# Altium schematic sheet LEDs.SchDoc
size A; SheetNumber: 3; SheetTotal: 5
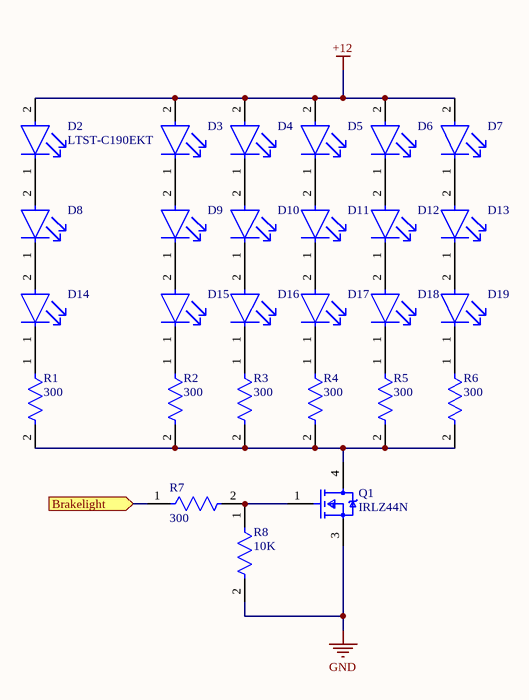
[diagram p0: LEDs.SchDoc]

## Parts
D2  LTST-C190EKT  [FP-LTST-C190EKT-MFG]
D3  LTST-C190EKT  [FP-LTST-C190EKT-MFG]  (value not drawn)
D4  LTST-C190EKT  [FP-LTST-C190EKT-MFG]  (value not drawn)
D5  LTST-C190EKT  [FP-LTST-C190EKT-MFG]  (value not drawn)
D6  LTST-C190EKT  [FP-LTST-C190EKT-MFG]  (value not drawn)
D7  LTST-C190EKT  [FP-LTST-C190EKT-MFG]  (value not drawn)
D8  LTST-C190EKT  [FP-LTST-C190EKT-MFG]  (value not drawn)
D9  LTST-C190EKT  [FP-LTST-C190EKT-MFG]  (value not drawn)
D10  LTST-C190EKT  [FP-LTST-C190EKT-MFG]  (value not drawn)
D11  LTST-C190EKT  [FP-LTST-C190EKT-MFG]  (value not drawn)
D12  LTST-C190EKT  [FP-LTST-C190EKT-MFG]  (value not drawn)
D13  LTST-C190EKT  [FP-LTST-C190EKT-MFG]  (value not drawn)
D14  LTST-C190EKT  [FP-LTST-C190EKT-MFG]  (value not drawn)
D15  LTST-C190EKT  [FP-LTST-C190EKT-MFG]  (value not drawn)
D16  LTST-C190EKT  [FP-LTST-C190EKT-MFG]  (value not drawn)
D17  LTST-C190EKT  [FP-LTST-C190EKT-MFG]  (value not drawn)
D18  LTST-C190EKT  [FP-LTST-C190EKT-MFG]  (value not drawn)
D19  LTST-C190EKT  [FP-LTST-C190EKT-MFG]  (value not drawn)
Q1  IRLZ44N  [FP-PG-TO263-3-MFG]
R1  300  [FP-CRCW1206-e3-IPC_A]
R2  300  [FP-CRCW1206-e3-IPC_A]
R3  300  [FP-CRCW1206-e3-IPC_A]
R4  300  [FP-CRCW1206-e3-IPC_A]
R5  300  [FP-CRCW1206-e3-IPC_A]
R6  300  [FP-CRCW1206-e3-IPC_A]
R7  300  [FP-CRCW1206-e3-IPC_A]
R8  10K  [FP-CRCW0603-e3-IPC_B]

## Ports
Brakelight (in)

## Nets
+12: D2.2(A) D3.2(A) D4.2(A) D5.2(A) D6.2(A) D7.2(A)
GND: Q1.3(S) R8.2
Brakelight: R7.1 ; port Brakelight
NetD2_1: D2.1(C) D8.2(A)
NetD3_1: D3.1(C) D9.2(A)
NetD4_1: D4.1(C) D10.2(A)
NetD5_1: D5.1(C) D11.2(A)
NetD6_1: D6.1(C) D12.2(A)
NetD7_1: D7.1(C) D13.2(A)
NetD8_1: D8.1(C) D14.2(A)
NetD9_1: D9.1(C) D15.2(A)
NetD10_1: D10.1(C) D16.2(A)
NetD11_1: D11.1(C) D17.2(A)
NetD12_1: D12.1(C) D18.2(A)
NetD13_1: D13.1(C) D19.2(A)
NetD14_1: D14.1(C) R1.1
NetD15_1: D15.1(C) R2.1
NetD16_1: D16.1(C) R3.1
NetD17_1: D17.1(C) R4.1
NetD18_1: D18.1(C) R5.1
NetD19_1: D19.1(C) R6.1
NetQ1_1: Q1.1(G) R7.2 R8.1
NetQ1_4: Q1.4(D) R1.2 R2.2 R3.2 R4.2 R5.2 R6.2

## Library data of the parts
D2-D19 = CMP-22017-000021-1: LED RED CLEAR CHIP SMD; Power Dissipation: 100mW; Lens Color: Colorless; Viewing Angle: 130°; Wavelength: 630nm; Number of Elements: 1; Reverse Voltage: 5V; Forward Current: 30mA; Dominant Wavelength: 621nm; Luminous Intensity: 2mcd; Test Current: 10mA; Forward Voltage: 2V; Length: 1.6mm; Lead Free: Lead Free; Lens Transparency: Clear; Max Operating Temperature: 85°C; Case Code (Metric): 1608; Case Code (Imperial): 0603; Number of Pins: 2; Color: Red; Depth: 0.8mm; Lens Style: Clear; Packaging: Tape and Reel; Height: 0.8mm; Case/Package: 0603; Min Operating Temperature: -55°C; Number of LEDs: 1; Illumination Color: Red; Mount: Surface Mount; Package Quantity: 1; Max Power Dissipation: 100mW; Power Rating: 100mW; Width: 0.8mm; Radiation Hardening: No
Q1 = CMP-32901-000495-1: MOSFET N-CH 55V 47A D2PAK; Rds On Max: 22mR; Input Capacitance: 1.7nF; Turn-On Delay Time: 11ns; Turn-Off Delay Time: 26ns; Power Dissipation: 110W; Element Configuration: Single; Gate to Source Voltage (Vgs): 16V; Drain to Source Resistance: 35mR; Threshold Voltage: 2V; Max Power Dissipation: 3.8W; Lead Free: Contains Lead; Max Dual Supply Voltage: 55V; Width: 0.38inch; Mount: Surface Mount; Continuous Drain Current (ID): 47A; Min Operating Temperature: -55°C; Number of Pins: 3; REACH SVHC: No SVHC; Height: 0.19inch; Length: 0.42inch; Case/Package: D2PAK; Drain to Source Breakdown Voltage: 55V; Packaging: Tape and Reel; Drain to Source Voltage (Vdss): 55V; Halogen Free: Halogen Free; RoHS Compliant: Yes; Max Operating Temperature: 175°C
R1-R7 = CMP-1014-00449-3: RES Thick Film, 300Ω, 1%, 0.25W, 100ppm/°C, 1206; Voltage Rating (DC): 200V; Power Rating: 250mW; Resistance: 300R; Number of Terminations: 2; Weight: 0.000353oz; Max Operating Temperature: 155°C; Features: Automotive AEC-Q200; Min Operating Temperature: -55°C; Case Code (Imperial): 1206; Voltage Rating: 200V; Termination: SMD/SMT; Military Standard: Not; Composition: Thick Film; Tolerance: 1%; Mount: Surface Mount; Package Quantity: 10; Length: 3.2mm; Depth: 1.6mm; Temperature Coefficient: 100ppm/°C; Width: 0.063inch; Contact Plating: Tin; Lead Free: Lead Free; Case Code (Metric): 3216; Radiation Hardening: No; Max Power Dissipation: 250mW; Working Voltage: 200V; Packaging: Tape and Reel; Height: 0.55mm; Case/Package: 1206
R8 = CMP-2000-03836-2: RES Thick Film, 10kΩ, 1%, 0.1W, 100ppm/°C, 0603; Voltage Rating: 75V; Max Power Dissipation: 100mW; Resistance: 10kR; Min Operating Temperature: -55°C; Packaging: Tape and Reel; Temperature Coefficient: 100ppm/°C; Case/Package: 0603; Max Operating Temperature: 155°C; Package Quantity: 10000; Voltage Rating (DC): 75V; Depth: 0.85mm; Case Code (Imperial): 0603; Power Rating: 100mW; Military Standard: Not; Height: 0.02inch; Weight: 7.1E-05oz; Number of Pins: 2; Width: 0.033inch; Number of Terminations: 2; Contact Plating: Tin; Length: 1.55mm; Features: Automotive AEC-Q200; Lead Free: Lead Free; Tolerance: 1%; Composition: Thick Film; Radiation Hardening: No; Case Code (Metric): 1608